# Altium schematic sheet BX-XH2.54-5PZZ-Y-COPY_2025-06-22.schdoc
size 39 x 37 mm
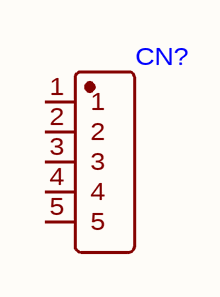
[diagram p0: BX-XH2.54-5PZZ-Y-COPY_2025-06-22.schdoc]

## Parts
CN?  (no value)  [CONN-TH_BX-XH2.54-5PZZ-Y]

## Nets

Not connected (* = marked no-connect by the designer): CN? 1 2 3 4 5

## Library data of the parts
CN? = BX-XH2.54-5PZZ-Y COPY